# Altium schematic sheet Half-Bridge Convertor_ir2161s.SchDoc
size 420 x 297 mm; SheetTotal: 1; PageSetup: Record=PageOptions|CenterHorizontal=True|CenterVertical=True|PrintScale=1.21|XCorrection=1.00|YCorrection=1.00|PrintKind=0|BorderSize=5000000|LeftOffset=0|BottomOffset=0|Orientation=2|PaperLength=1000|PaperWidth=1000|Scale=100|PaperSource=260|PrintQuality=600|MediaType=1|DitherType=10|PaperKind=A3|PrintScaleMode=1
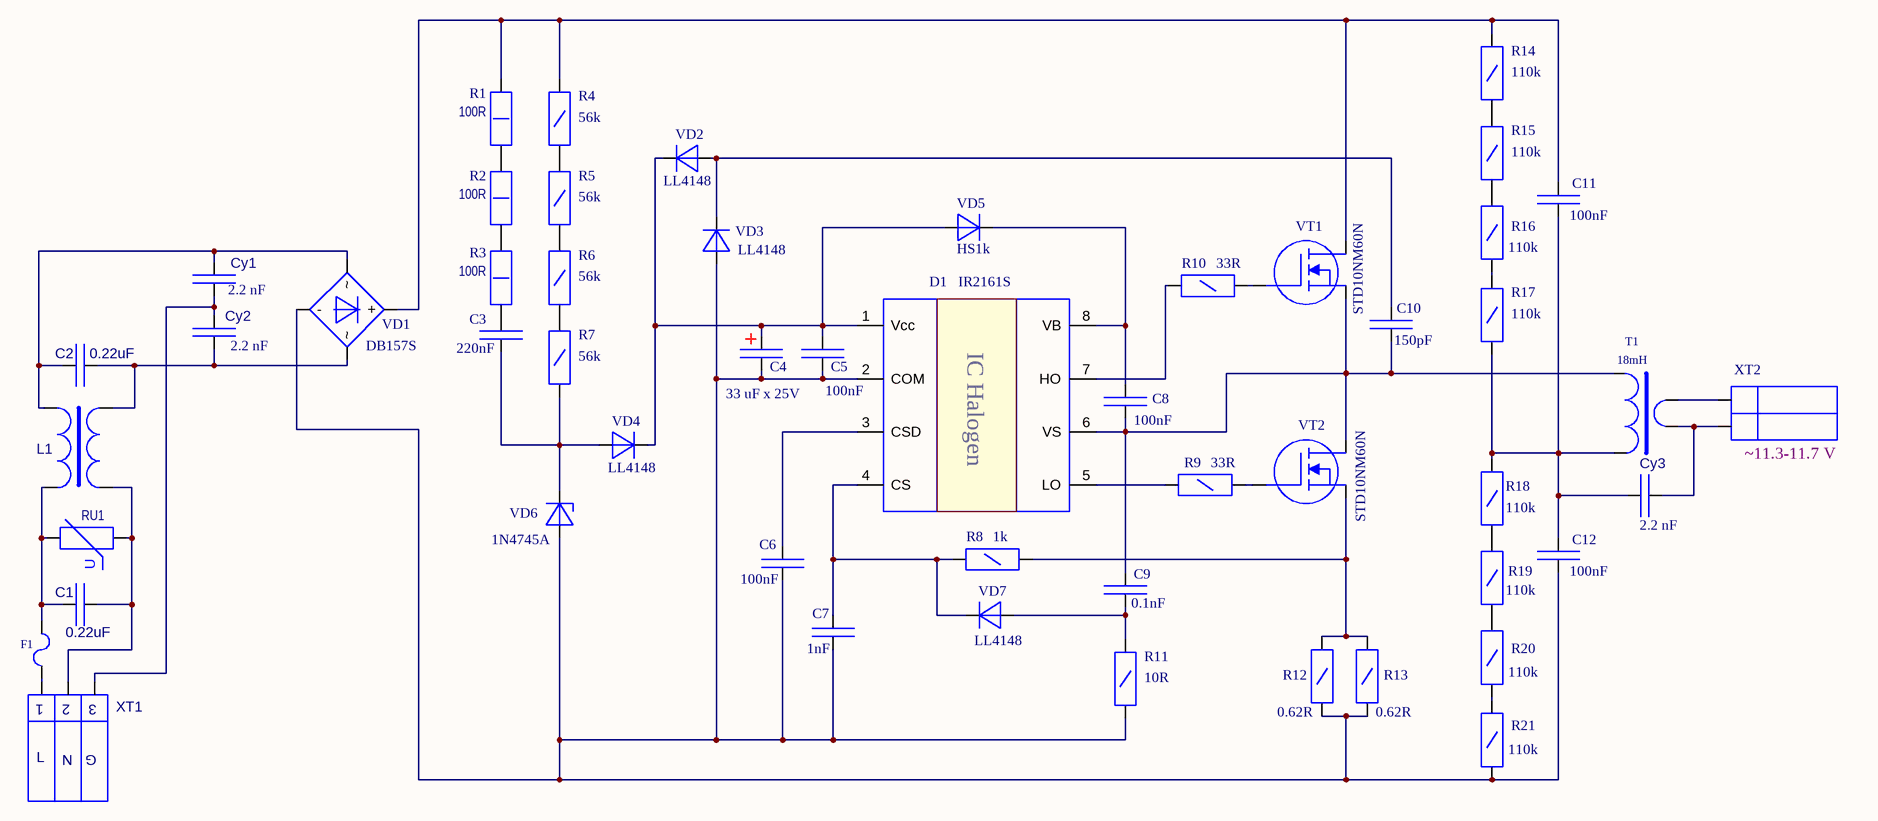
[diagram p0: Half-Bridge Convertor_ir2161s.SchDoc]

## Parts
C1  value 0.22uF  [CAPR9.0x18.0-15.0]  (hidden comment: Cap_MKP)
C2  value 0.22uF  [CAPR9.0x18.0-15.0]  (hidden comment: Cap_MKP)
C3  value 220nF  [C2220]  (hidden comment: Cap1)
C4  value 33 uF x 25V  [CAPR5-4X5]  (hidden comment: Cap Pol)
C5  value 100nF  [CAPC2012 (0805)]  (hidden comment: Cap1)
C6  value 100nF  [CAPC2012 (0805)]  (hidden comment: Cap1)
C7  value 1nF  [CAPC2012 (0805)]  (hidden comment: Cap1)
C8  value 100nF  [CAPC3216N]  (hidden comment: Cap1)
C9  value 0.1nF  [CAPC2012 (0805)]  (hidden comment: Cap1)
C10  value 150pF  [CAPR5.0x13.0-5.0]  (hidden comment: Cap1)
C11  value 100nF  [CAPR9.0x18.0-15.0]  (hidden comment: Cap1)
C12  value 100nF  [CAPR9.0x18.0-15.0]  (hidden comment: Cap1)
Cy1  value 2.2 nF  [CAPR Y - 7.5]  (hidden comment: Cap1)
Cy2  value 2.2 nF  [CAPR Y - 7.5]  (hidden comment: Cap1)
Cy3  value 2.2 nF  [CAPR Y - 7.5]  (hidden comment: Cap1)
D1  IR2161S  [SO8_M]
F1  Fuse3  [Fuse - PCB]  (value not drawn)  (net tie, no BOM)
L1  Trans EMI  [YEE19-353D]  (value not drawn)
R1  value 100R  [RESC6332]  (hidden comment: Res 1W_1)
R2  value 100R  [RESC6332]  (hidden comment: Res 1W_1)
R3  value 100R  [RESC6332]  (hidden comment: Res 1W_1)
R4  value 56k  [RESC3216(1206)N]  (hidden comment: Res 1/4W)
R5  value 56k  [RESC3216(1206)N]  (hidden comment: Res 1/4W)
R6  value 56k  [RESC3216(1206)N]  (hidden comment: Res 1/4W)
R7  value 56k  [RESC3216(1206)N]  (hidden comment: Res 1/4W)
R8  value 1k  [RESC3216(1206)N]  (hidden comment: Res 1/4W)
R9  value 33R  [RESC3216(1206)N]  (hidden comment: Res 1/8W)
R10  value 33R  [RESC3216(1206)N]  (hidden comment: Res 1/8W)
R11  value 10R  [RESC3216(1206)N]  (hidden comment: Res 1/4W)
R12  value 0.62R  [RESC3216(1206)N]  (hidden comment: Res 1/4W)
R13  value 0.62R  [RESC3216(1206)N]  (hidden comment: Res 1/4W)
R14  value 110k  [RESC3216(1206)N]  (hidden comment: Res 1/4W)
R15  value 110k  [RESC3216(1206)N]  (hidden comment: Res 1/4W)
R16  value 110k  [RESC3216(1206)N]  (hidden comment: Res 1/4W)
R17  value 110k  [RESC3216(1206)N]  (hidden comment: Res 1/4W)
R18  value 110k  [RESC3216(1206)N]  (hidden comment: Res 1/4W)
R19  value 110k  [RESC3216(1206)N]  (hidden comment: Res 1/4W)
R20  value 110k  [RESC3216(1206)N]  (hidden comment: Res 1/4W)
R21  value 110k  [RESC3216(1206)N]  (hidden comment: Res 1/4W)
RU1  Varistor  [VAristor 7.5-11x5]  (value not drawn)
T1  Value2: 18mH  [HLT-R29.5-18mH-0-g]  (hidden comment: HLT-R29.5-18mH-0-g)
VD1  value DB157S  [DB-1S]  (hidden comment: Diode Bridge)
VD2  value LL4148  [MELF-D3516-1406]  (hidden comment: Diode LL4148)
VD3  value LL4148  [MELF-D3516-1406]  (hidden comment: Diode LL4148)
VD4  value LL4148  [MELF-D3516-1406]  (hidden comment: Diode LL4148)
VD5  value HS1k  [CD4532-1812 (mod)]  (hidden comment: Diode HS1x)
VD6  value 1N4745A  [DO-41]  (hidden comment: Diode Zener)
VD7  value LL4148  [MELF-D3516-1406]  (hidden comment: Diode LL4148)
VT1  value STD10NM60N  [D-PAK (TO252)]  (hidden comment: IRFBC40S)
VT2  value STD10NM60N  [D-PAK (TO252)]  (hidden comment: IRFBC40S)
XT1  Connect x3  [ZIP-Ballast3]  (value not drawn)
XT2  Connect x2  [ZIP-Ballast2x3]  (value not drawn)

## Nets
NetC1_1: C1.1 L1.2(Sec-) RU1.1 XT1.2
NetC1_2: C1.2 F1.1 L1.3(Pri-) RU1.2
NetC2_1: C2.1 Cy2.1 L1.1(Sec+) VD1.2
NetC2_2: C2.2 Cy1.2 L1.4(Pri+) VD1.1
NetC3_1: C3.1 R7.2 VD4.1 VD6.2
NetC3_2: C3.2 R3.2
NetC4_1: C4.1 C5.2 D1.1(Vcc) VD2.2 VD4.2 VD5.1
NetC4_2: C4.2 C5.1 C6.1 C7.1 C12.1 D1.2(COM) R11.2 R12.2 R13.2 R21.2 VD1.4(-) VD3.1 VD6.1
NetC6_2: C6.2 D1.3(CSD)
NetC7_2: C7.2 D1.4(CS) R8.1 VD7.2
NetC8_1: C8.1 C9.2 C10.2 D1.6(VS) T1.2(Pri+) VT1.3(S) VT2.2(D)
NetC8_2: C8.2 D1.8(VB) VD5.2
NetC9_1: C9.1 R11.1 VD7.1
NetC10_1: C10.1 VD2.1 VD3.2
NetC11_1: C11.1 C12.2 Cy3.2 R17.2 R18.2 T1.1(Pri-)
NetC11_2: C11.2 R1.1 R4.1 R14.1 VD1.3(+) VT1.2(D)
NetCy1_1: Cy1.1 Cy2.2 XT1.3
NetCy3_1: Cy3.1 T1.4(Sec-) XT2.1
NetD1_5: D1.5(LO) R9.1
NetD1_7: D1.7(HO) R10.1
NetF1_1: F1.1 XT1.1
NetR1_2: R1.2 R2.1
NetR2_2: R2.2 R3.1
NetR4_2: R4.2 R5.1
NetR5_2: R5.2 R6.1
NetR6_2: R6.2 R7.1
NetR8_2: R8.2 R12.1 R13.1 VT2.3(S)
NetR9_2: R9.2 VT2.1(G)
NetR10_2: R10.2 VT1.1(G)
NetR14_2: R14.2 R15.1
NetR15_2: R15.2 R16.1
NetR16_2: R16.2 R17.1
NetR18_1: R18.1 R19.1
NetR19_2: R19.2 R20.1
NetR20_2: R20.2 R21.1
NetT1_3: T1.3(Sec+) XT2.2

## Notes on the sheet
- (near XT2) ~11.3-11.7 V
- (near XT1) 1
- (near XT1) 2
- N
- (near XT1) 3
- G
- L
- Подп. дата
- Инв. № дубл.
- Взам. инв. №
- Подп. и дата
- Изм.
- Лист.
- № докум.
- Подп.
- Дата
- Лит.
- Масса
- Масштаб
- Разраб.
- Пров.
- Т. контр.
- Лист 1
- Листов
- 1:1
- Инв. № подп.
- Н. контр.
- Утв.
- (in symbol IR2161S) IC Halogen
- (in symbol Varistor) U

## Library data of the parts
C1 C2 = Cap_MKP: Cap DIP (MKP); Voltage: 275VAC/400VDV; Function: EMI Filter; Tolerance: 20%; Dielectric: Polypropylene (MKP) - X2 class; PackageDescription: Radial, Thru-Hole Body 9.0x18.0x18.0mm(WxLxH), Pin Spacing 15.0mm; Supplier 1: *; Supplier Part Number 1: *
C3 = Cap1: Capacitor GOST; Part Number: 0.22мкФ X7R 10% 630В 2220, GRM55DR72J224K; Voltage: 630 V; Function: CD; Tolerance: 10%; Dielectric: X7R; PackageDescription: Chip Capasitor 2220
C4 = Cap Pol: Cap Pol GOST; Tolerance: 10%; Function: CVcc; Supplier: *; PackageDescription: Radial, Thru-Hole Body 13.0x25.0 (DxH)mm, Pin Spacing 5.0mm
C5 = Cap1: Capacitor GOST; Part Number: GRM21X7R102J50; Voltage: 25 V; Function: CVcc; Dielectric: X7R; Tolerance: 5%/10%; PackageDescription: Chip Capasitor; Package Reference: C0805
C6 = Cap1: Capacitor GOST; Voltage: 25 V; Function: CSD; Dielectric: X7R; Tolerance: 5%/10%; PackageDescription: Chip Capasitor; Package Reference: C0805
C7 = Cap1: Capacitor GOST; Voltage: 25 V; Function: CF; Dielectric: X7R; Tolerance: 5%/10%; PackageDescription: Chip Capasitor; Package Reference: C0805
C8 = Cap1: Capacitor GOST; Voltage: 50 V; Function: CBoot; Dielectric: X7R; Tolerance: 5%/10%; PackageDescription: Chip Capasitor; Package Reference: C1206
C9 = Cap1: Capacitor GOST; Voltage: 50 V; Function: COC; Dielectric: X7R; Tolerance: 5%/10%; PackageDescription: Chip Capasitor; Package Reference: C0805
C10 = Cap1: Capacitor GOST; Voltage: 1kV; Function: CSnuub; Tolerance: 10 %; Dielectrik: Polypropyline; PackageDescription: Radial Capacitor; Package Reference: Capacitor class X 2,Thru-Hole Body 5.0 x 13.0 mm (WxT) Pin Spacing 5.0 mm; Part Number: *; Supplier: *; Supplier Part Number: *
C11 C12 = Cap1: Capacitor GOST; Voltage: 630V; PackageDescription: Radial Capacitor; Package Reference: Thru-Hole, Pin spacing 7.5mm; Function: *; Part Number: *; Tolerance %: *; Supplier: *; Supplier Part Number: *
Cy1-Cy3 = Cap1: Capacitor GOST; Part Number: MKY22W12203D00; Voltage: 275 VAC; Function: Y-Cap; Tolerance: 5 %; Dielectrik: MKP-Y2; PackageDescription: Radial Capacitor; Package Reference: *
D1 = IR2161S: IC Halogen Converter; Functuion: *; PackageReference: *; Supplier 1: Digi-Key; Value: IR2161S
F1 = Fuse3: Fuse GOST
L1 = Trans EMI: Trans EMI (GOST); Function: EMI Filter; Value: YEE19-35D; PackageDescription: *
R1-R3 = Res 1W_1: Resistor GOST; Function: RD; Tolerance: 5%; Power rating: 1W; PackageDescription: Chip Resistor 2512; PackageReference: *; Part Number: *
R4-R7 = Res 1/4W: Resistor GOST; Function: R Supply; Tolerance: 5%; PackageDescription: Chip Resistor 1206; PackageReference: 1/4W
R8 = Res 1/4W: Resistor GOST; Function: RF; Tolerance: 5%; PackageDescription: Chip Resistor; PackageReference: R1206
R9 R10 = Res 1/4W: Resistor GOST; Function: RGate1; PackageDescription: Chip Resistor R1206; Part Number: *
R11 = Res 1/4W: Resistor GOST; Function: ROC; Tolerance: 5%; PackageDescription: Chip Resistor; PackageReference: R1206
R12 R13 = Res 1/4W: Resistor GOST; Function: RCS; Tolerance: 5%; PackageDescription: Chip Resistor 1206
R14-R21 = Res 1/4W: Resistor GOST; Tolerance: 5%; PackageDescription: Chip Resistor 1206; PackageReference: 1/4W
RU1 = Varistor: Varistor GOST; Part Number: ERZ-V05D471; Function: Transient Suppressor; Value: *; PackageReference: Varistor, Thru-Hole, Disc; Body 11 x 5 mm (LxW max) Pin Spacing 7.5 mm (typ)
T1 = Choke HLT- 50W/12V_1: Function: Choke HLT; PackageDescription: R29.5/19/14.9; Value: HLT-R29.5-18mH-0-g
VD1 = Diode Bridge: Diode Bridge GOST; Function: Rectifier bridge; PackageReference: *; PackageDescription: *; Part Number: *; Supplier 1: Mouser; Supplier Part Number 1: 583-DB157SC
VD2 VD4 = Diode LL4148: Diode LL4148 (GOST); Function: DCP1; Package Description: MiniMELF; Part Number: *
VD3 = Diode LL4148: Diode LL4148 (GOST); Function: DCP2; Package Description: MiniMELF; Part Number: *
VD5 = Diode HS1x: Diode HS1x (GOST); Function: DBoot; Package Description: Chip Diode; Body 4.5 x 3.2 mm (LxW typ); Part Number: *
VD6 = Diode Zener: Diode Zener GOST; Function: Zener Diode 16V/1W; PackageReference: *; PackageDescription: DO-41; Part Number: *
VD7 = Diode LL4148: Diode LL4148 (GOST); Function: DOC; Package Description: MiniMELF; Part Number: *
VT1 VT2 = FQD5N50: MOSFET N-channel (GOST); Function: MOSFET N-channel 500V/0.5Ohm/10A; Package Description: D-PAK (TO-252); Package Reference: *; Part Number: *
XT1 = Connect x3: Connect x3 GOST; Function: Input connector
XT2 = Connect x2: Connect x2 GOST